# EAGLE design fet_h220-1 (EAGLE 5.06)
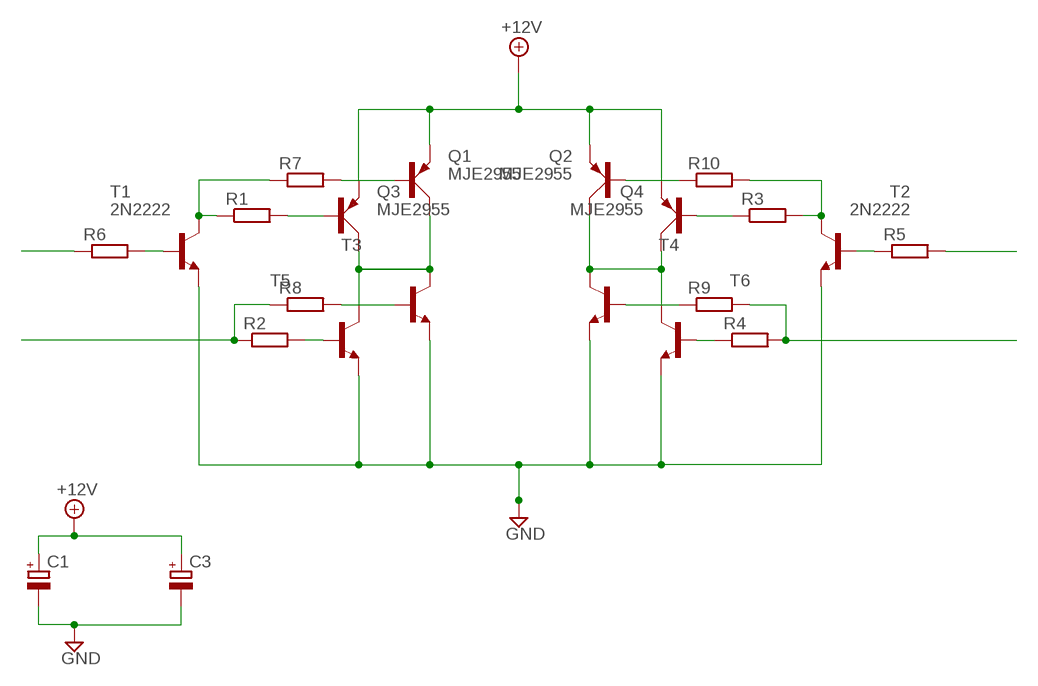
[diagram p0: schematic, sheet 1]

## Parts
C1  CPOL-EUE5-13  [E5-13]
C3  CPOL-EUE5-13  [E5-13]
Q1  MJE2955  [TO220AV]
Q2  MJE2955  [TO220AV]
Q3  MJE2955  [TO220AV]
Q4  MJE2955  [TO220AV]
R1  R-EU_0204/7  [0204/7]
R2  R-EU_0204/7  [0204/7]
R3  R-EU_0204/7  [0204/7]
R4  R-EU_0204/7  [0204/7]
R5  R-EU_0204/7  [0204/7]
R6  R-EU_0204/7  [0204/7]
R7  R-EU_0204/7  [0204/7]
R8  R-EU_0204/7  [0204/7]
R9  R-EU_0204/7  [0204/7]
R10  R-EU_0204/7  [0204/7]
T1  2N2222  [TO18]
T2  2N2222  [TO18]
T3  -NPN-TO220V  [TO220V]
T4  -NPN-TO220V  [TO220V]
T5  -NPN-TO220V  [TO220V]
T6  -NPN-TO220V  [TO220V]

## Nets
+12V: C1.+ C3.+ Q1.E Q2.E Q3.E Q4.E
GND: C1.- C3.- T1.1(E) T2.1(E) T3.3(E) T4.3(E) T5.3(E) T6.3(E)
N$1: R1.1 R7.1 T1.3(C)
N$2: Q3.B R1.2
N$3: Q2.C Q4.C T4.2(C) T6.2(C)
N$4: R4.2 R9.2
N$5: Q1.C Q3.C T3.2(C) T5.2(C)
N$8: Q4.B R3.1
N$10: R6.2 T1.2(B)
N$11: R5.1 T2.2(B)
N$12: R3.2 R10.2 T2.3(C)
N$13: Q1.B R7.2
N$15: R4.1 T6.1(B)
N$19: R5.2
N$21: Q2.B R10.1
N$23: R9.1 T4.1(B)
N$24: R8.2 T3.1(B)
N$26: R2.2 T5.1(B)
N$27: R2.1 R8.1
N$28: R6.1

## Library data of the parts
C1 C3 = rcl:CPOL-EU: POLARIZED CAPACITOR, European symbol
Q1-Q4 = transistor-power:MJE2955: PNP TRANSISTOR
R1-R10 = resistor:R-EU_: RESISTOR, European symbol
T1 T2 = transistor:2N2222: NPN TRANSISTOR
T3-T6 = transistor-neu-to92:*-NPN-: NPN Transistror

## Board
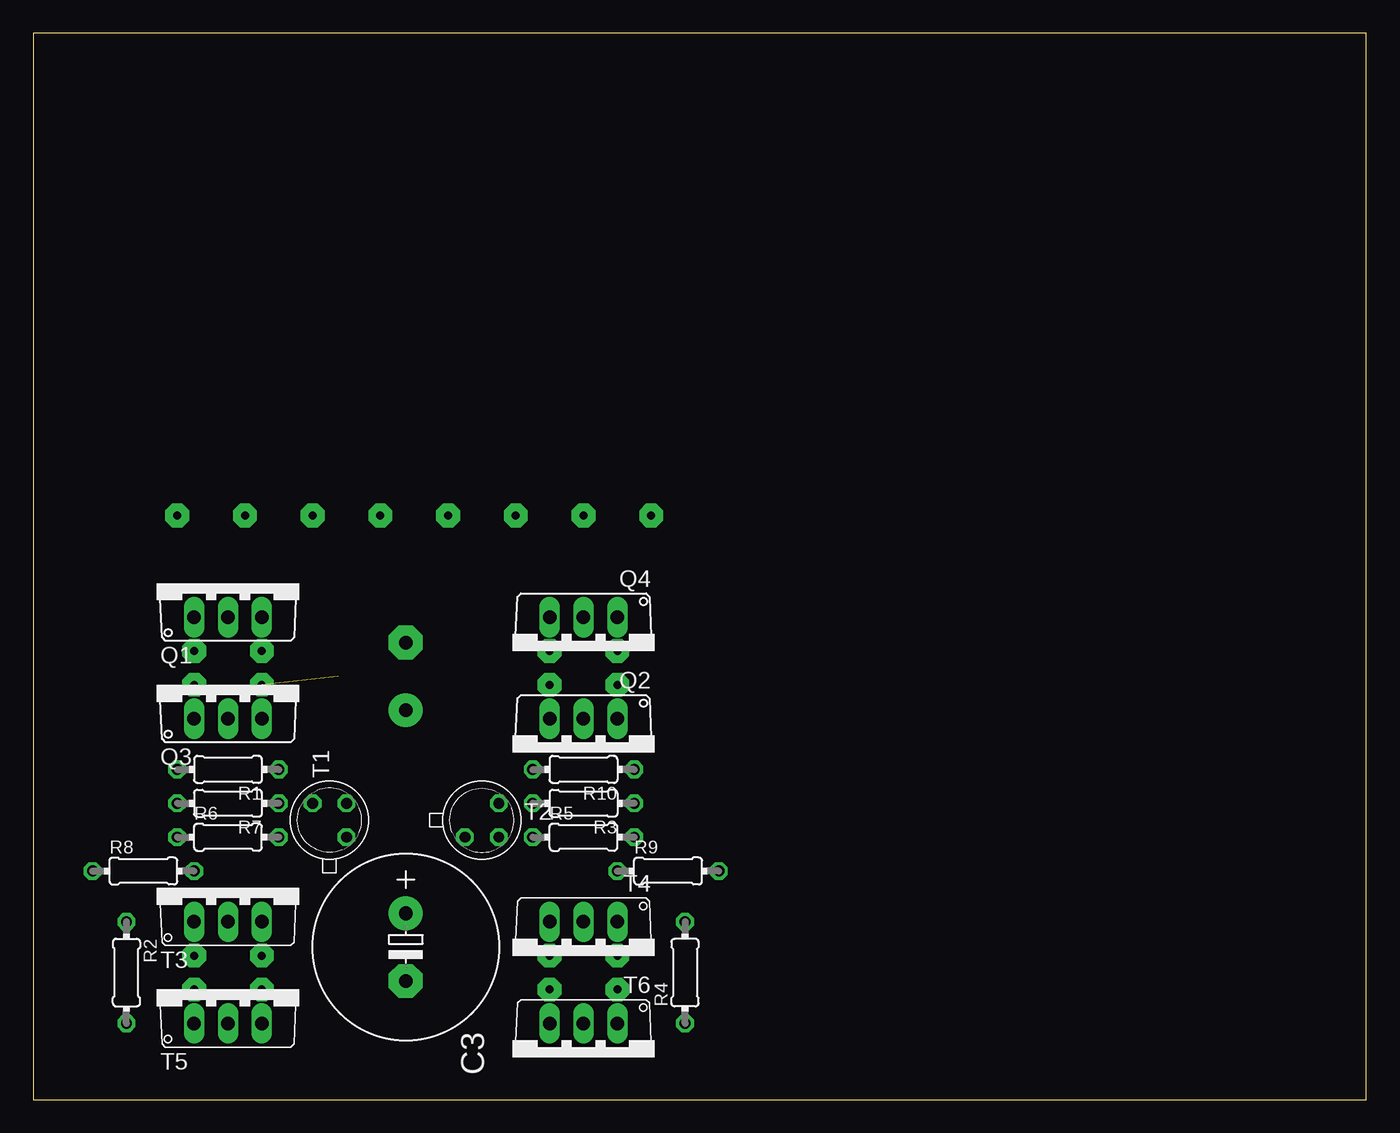
[diagram p1: board, top side]
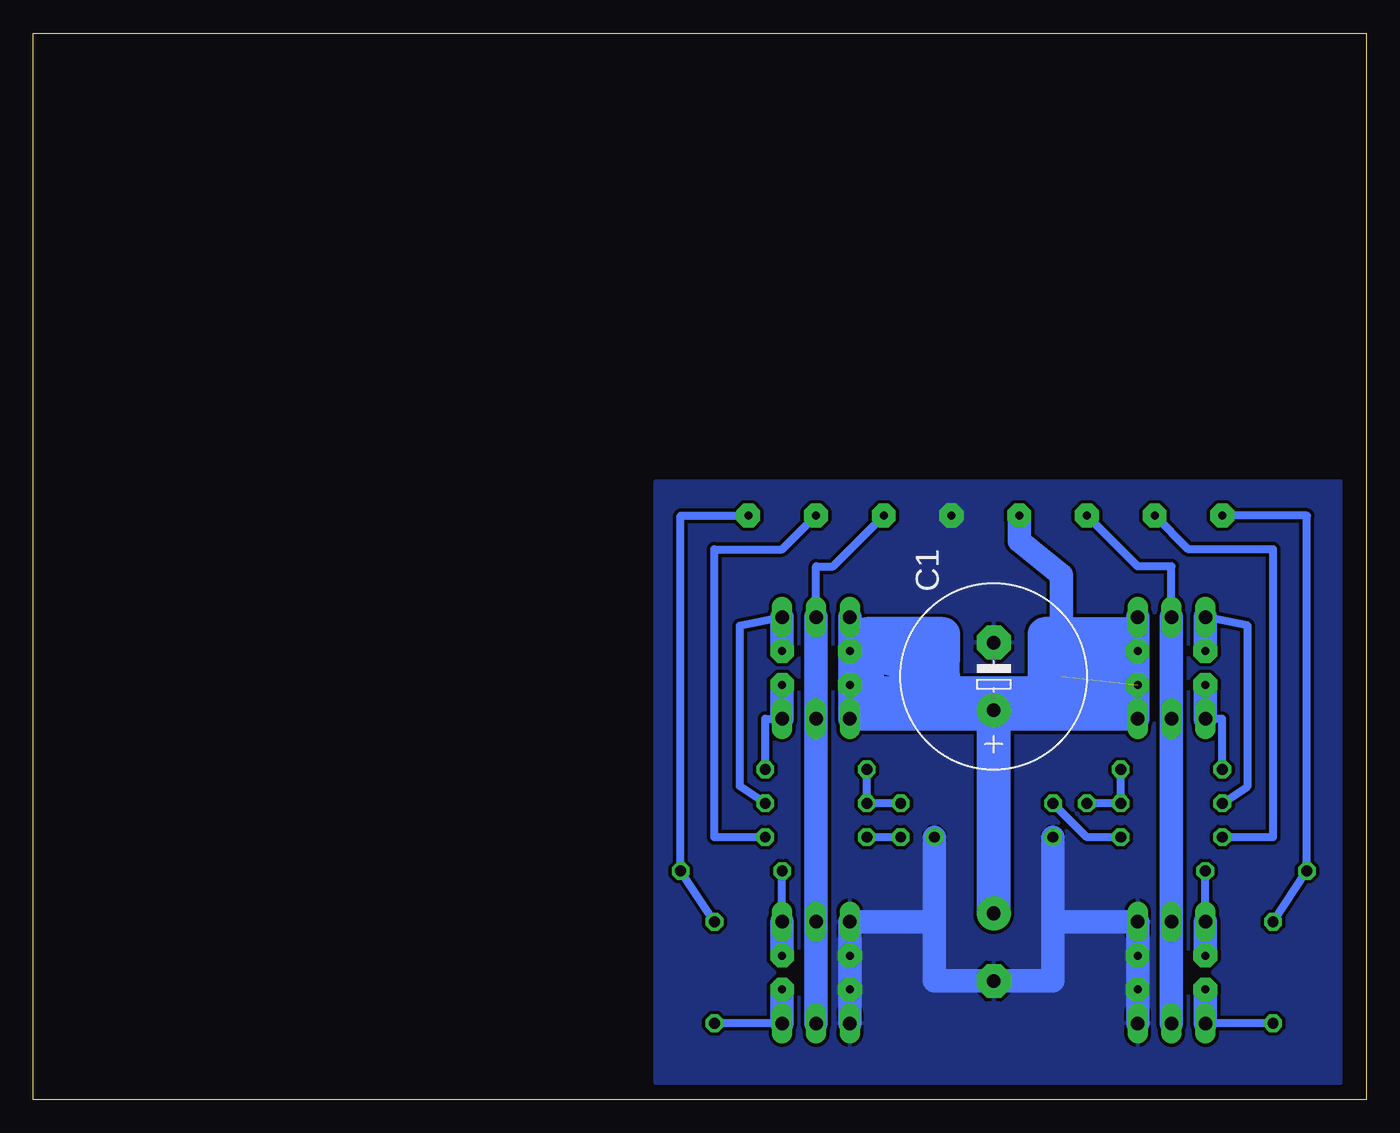
[diagram p2: board, bottom side, seen from below]

Size 100 x 80 mm. Coordinates in mm from the lower left corner, seen from the top.
Outline: 0,0 100,0 100,80 0,80 0,0
Copper layers (1*16): Top 0.035mm / dielectric 1.5mm / Bottom 0.035mm
Design rules "default *": minimum track width 10mil, minimum drill 24mil, track to track 10mil, track to pad 10mil, pad to pad 8mil, via to via 8mil, smd to smd 8mil, copper to edge 40mil, drill to drill 8mil, minimum pad ring 10mil, minimum via ring 8mil, stop-mask expansion 4mil, vias tented up to drill 0mil, thermal gap 10mil

### Footprints (pad centres in the part's own frame; a part is rotated, then mirrored left to right if it is on the bottom)
E5-13 = drill 1.016 pad 2.54 round: + -2.54,0 | drill 1.016 pad 2.54 octagon: - 2.54,0
TO220AV = drill 1.016 long: B -2.54,-2.54; C 0,-2.54; E 2.54,-2.54
0204/7 = drill 0.813 octagon: 1 -3.81,0; 2 3.81,0
TO18 = drill 0.813 octagon: 1 -1.27,-1.27; 2 1.27,-1.27; 3 1.27,1.27
TO220V = drill 1.016 long: 1 -2.54,-2.54; 2 0,-2.54; 3 2.54,-2.54

### Placement (x,y rotation side)
C1  27.94,31.75 90 bottom
C3  27.94,11.43 270 top
Q1  14.61,38.73 0 top
Q2  41.27,26.04 180 top
Q3  14.61,31.11 0 top
Q4  41.27,33.66 180 top
R1  14.61,24.77 180 top
R2  6.99,9.53 270 top
R3  41.27,22.23 180 top
R4  48.9,9.53 90 top
R5  41.27,19.68 0 top
R6  14.61,19.68 0 top
R7  14.61,22.23 180 top
R8  8.26,17.14 0 top
R9  47.62,17.14 0 top
R10  41.27,24.77 180 top
T1  22.23,20.95 90 top
T2  33.66,20.95 0 top
T3  14.61,15.88 0 top
T4  41.27,10.79 180 top
T5  14.61,8.26 0 top
T6  41.27,3.17 180 top

### Tracks (layer width: path | path; a pad name or v marks a point on that pad's centre or on a via)
+12V  (via drill 0.6 pad 1.78)  (1 unrouted)
  Bottom 1.778: Q1.E v17.14,33.66 v17.14,31.11 Q3.E Q2.E v38.73,31.11 v38.73,33.66 Q4.E | v26.04,43.81 26.04,41.91 22.86,39.37 22.86,31.75 26.04,29.21 C1.+
  Bottom 2.54: C3.+ C1.+
GND  (via drill 0.6 pad 1.78)
  Bottom 1.778: T6.3 v38.73,8.26 v38.73,10.79 T4.3 32.38,13.34 T2.1 32.38,8.89 23.5,8.89 T1.1 23.5,13.34 T3.3 v17.14,10.79 v17.14,8.26 T5.3
  other vias: 31.11,43.81
  pour Bottom: 1.91,46.35 53.34,46.35 53.34,1.27 1.91,1.27
N$1
  Bottom 0.61: R1.1 R7.1 T1.3
N$2  (via drill 0.6 pad 1.78)
  Bottom 0.61: R1.2 10.79,28.57 Q3.B
  Bottom 1.778: Q3.B v12.06,31.11
N$3  (via drill 0.6 pad 1.78)
  Bottom 0.61: Q4.C 41.27,40.01 40.01,40.01 v36.2,43.81
  Bottom 1.778: T6.2 T4.2 Q2.C Q4.C
N$4  (via drill 0.6 pad 1.78)
  Bottom 0.61: R4.2 R9.2 51.44,43.81 v46.35,43.81
N$5  (via drill 0.6 pad 1.78)
  Bottom 0.61: v20.95,43.81 17.14,40.01 14.61,40.01 Q1.C
  Bottom 1.778: T5.2 T3.2 Q3.C Q1.C
N$6
  Bottom 2.54: 17.78,30.48 18.41,30.48 | 18.41,30.48 37.47,30.48 | 17.78,29.84 17.78,30.48 | 17.78,30.48 17.78,31.11 18.41,30.48 | 18.41,30.48 38.1,30.48 | 18.41,30.48 23.5,31.11 23.5,34.92 22.86,34.92 | 22.86,34.92 18.41,34.92 | 18.41,34.92 17.78,34.92 | 18.41,34.92 18.41,33.02 21.59,33.02 | 22.86,34.92 24.13,34.92 24.13,31.75
N$7
  Bottom 2.54: 37.47,31.75 37.47,34.92 31.75,34.92 | 31.75,34.92 31.75,33.02 35.56,33.02 | 31.75,31.75 31.75,34.92
N$8  (via drill 0.6 pad 1.78)
  Bottom 0.61: R3.1 46.99,23.5 46.99,35.56 Q4.B
  Bottom 1.778: Q4.B v43.81,33.66
N$10
  Bottom 0.61: R6.2 20.95,19.68 T1.2
N$11
  Bottom 0.61: T2.2 R5.1
N$12
  Bottom 0.61: T2.3 R3.2 R10.2
N$13  (via drill 0.6 pad 1.78)
  Bottom 0.61: R7.2 8.89,23.5 8.89,35.56 Q1.B
  Bottom 1.778: Q1.B v12.06,33.66
N$15  (via drill 0.6 pad 1.78)
  Bottom 0.61: T6.1 R4.1
  Bottom 1.778: T6.1 v43.81,8.26
N$19  (via drill 0.6 pad 1.78)
  Bottom 0.61: v41.27,43.81 43.81,41.27 48.9,41.27 48.9,19.68 R5.2
N$21  (via drill 0.6 pad 1.78)
  Bottom 0.61: R10.1 45.09,28.57 Q2.B
  Bottom 1.778: Q2.B v43.81,31.11
N$23  (via drill 0.6 pad 1.78)
  Bottom 0.61: T4.1 R9.1
  Bottom 1.778: v43.81,10.79 T4.1
N$24  (via drill 0.6 pad 1.78)
  Bottom 0.61: T3.1 R8.2
  Bottom 1.778: v12.06,10.79 T3.1
N$26  (via drill 0.6 pad 1.78)
  Bottom 0.61: R2.2 T5.1
  Bottom 1.778: T5.1 v12.06,8.26
N$27  (via drill 0.6 pad 1.78)
  Bottom 0.61: R2.1 R8.1 4.45,43.81 v10.79,43.81
N$28  (via drill 0.6 pad 1.78)
  Bottom 0.61: R6.1 6.99,19.68 6.99,41.27 13.34,41.27 v15.88,43.81